# EAGLE design EC60_1 (EAGLE 7.4.1)
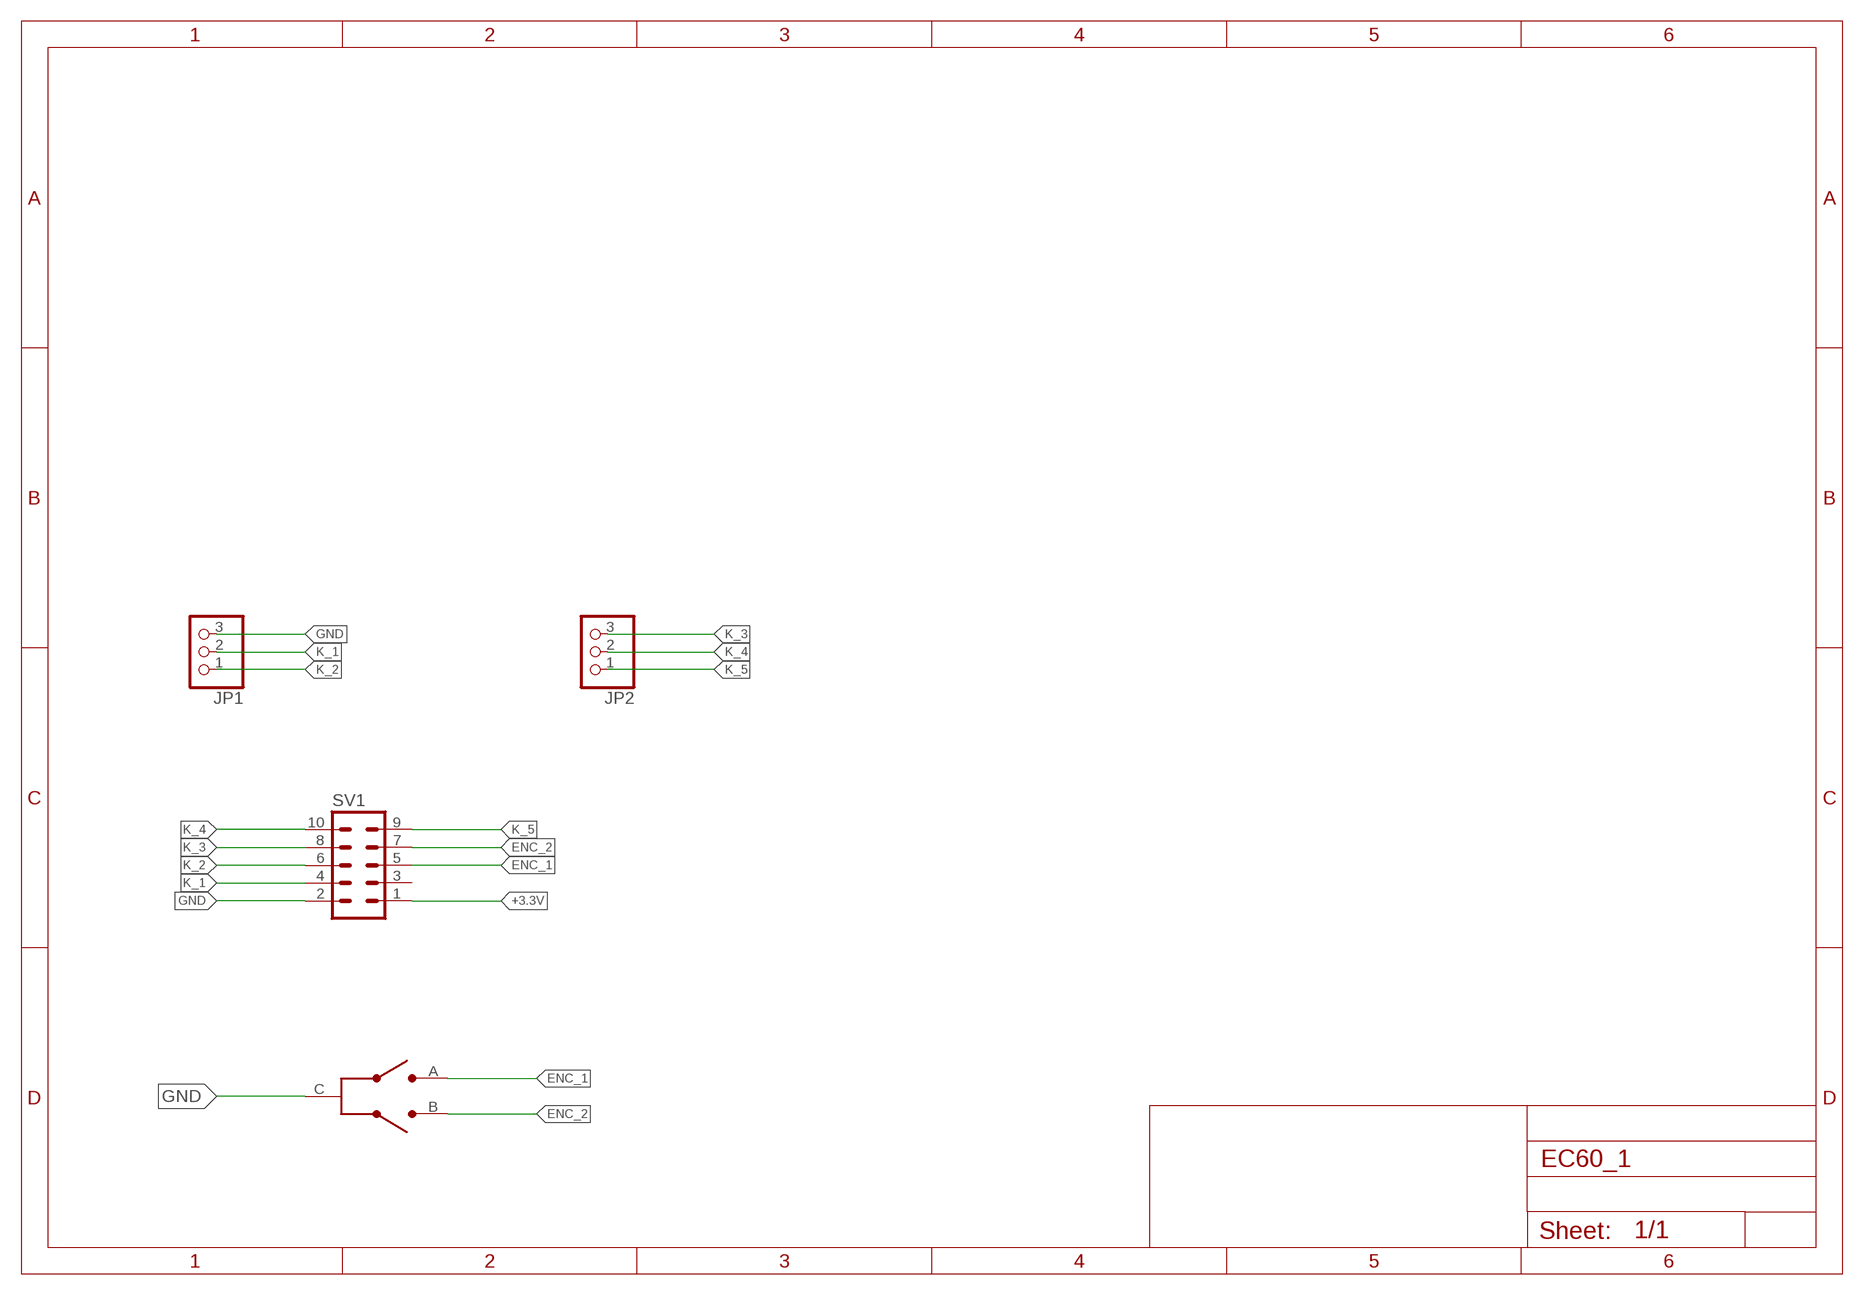
[diagram p0: schematic, sheet 1]

## Parts
JP1  PINHD-1X3  [1X03]
JP2  PINHD-1X3  [1X03]
SV1  ML10L  [ML10L]
U$1  EC60A  [EC60A]

## Nets
+3.3V: SV1.1
ENC_1 [SUPPLY]: SV1.5 U$1.A
ENC_2 [SUPPLY]: SV1.7 U$1.B
GND [SUPPLY]: JP1.3 SV1.2 U$1.C
K_1 [SUPPLY]: JP1.2 SV1.4
K_2 [SUPPLY]: JP1.1 SV1.6
K_3 [SUPPLY]: JP2.3 SV1.8
K_4 [SUPPLY]: JP2.2 SV1.10
K_5 [SUPPLY]: JP2.1 SV1.9
Unconnected: SV1.3

## Library data of the parts
JP1 JP2 = pinhead:PINHD-1X3: PIN HEADER
SV1 = con-harting-ml:ML10: HARTING; OC_FARNELL: unknown; OC_NEWARK: unknown
U$1 = ALPS-EC60A:EC60A

## Net classes
1 SUPPLY: width 0.254 mm

## Board
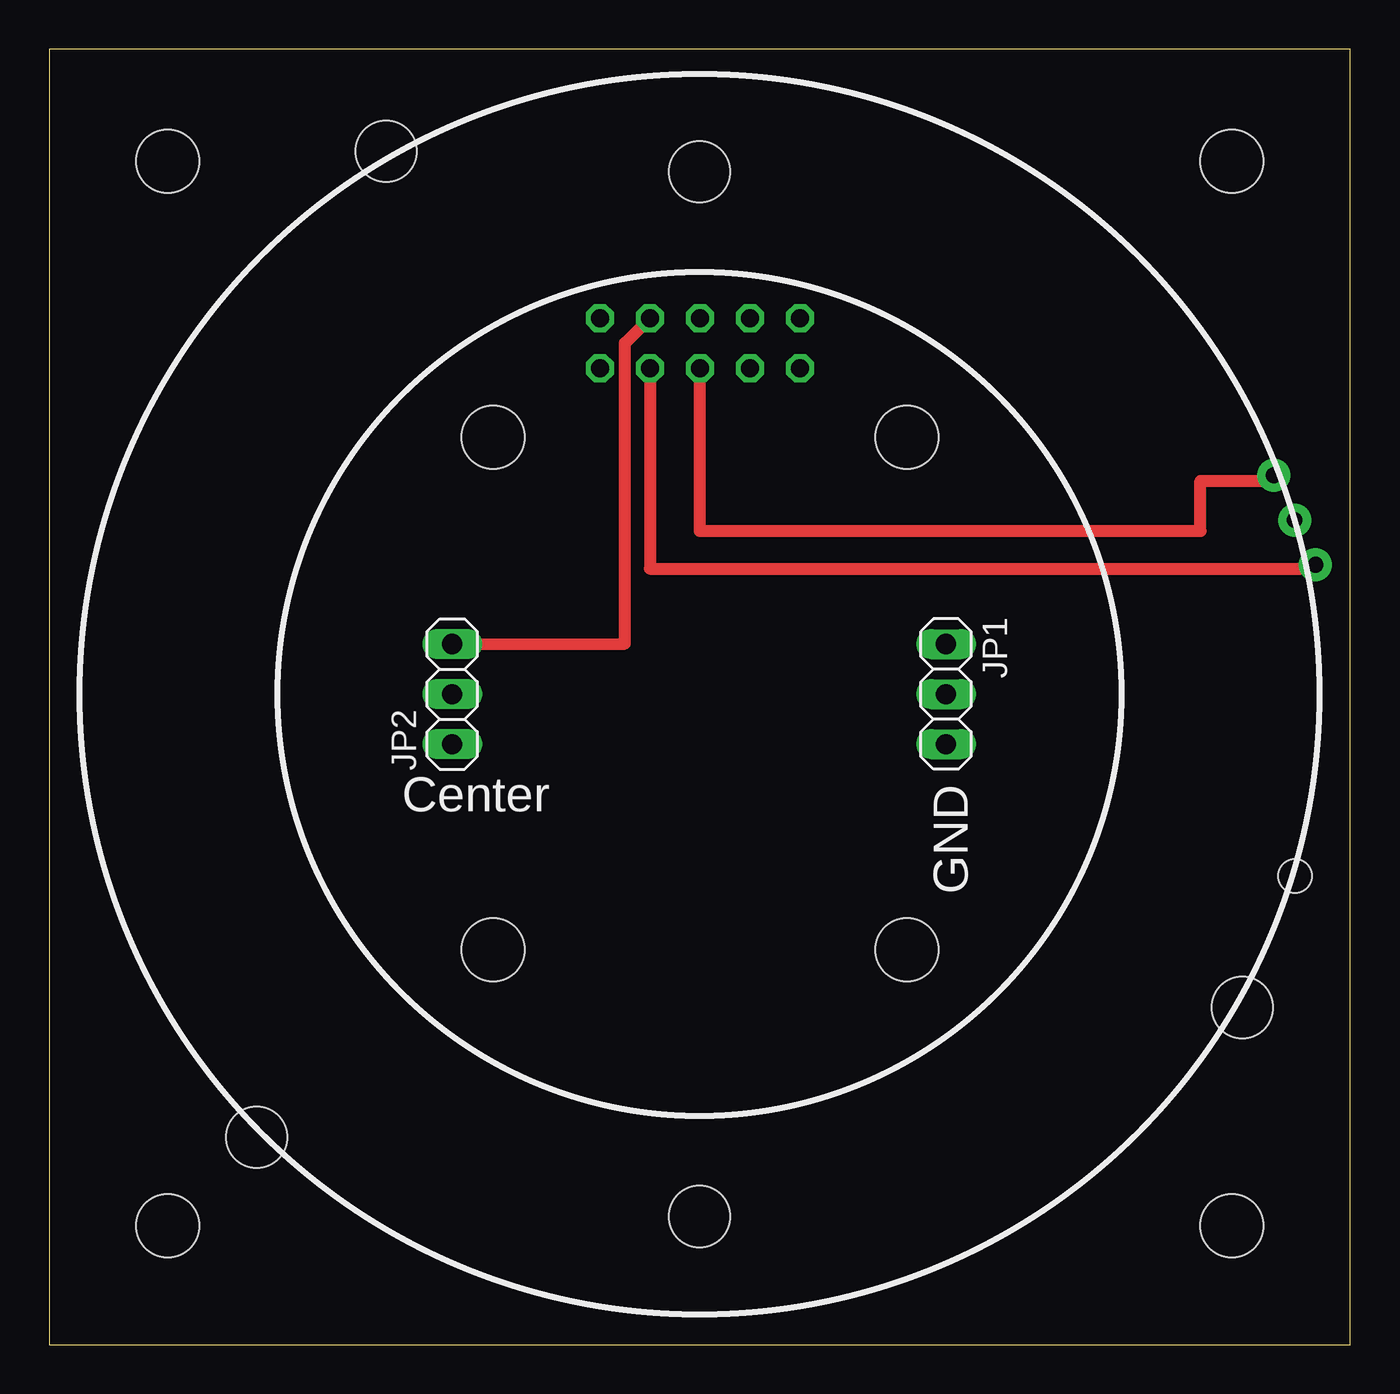
[diagram p1: board, top side]
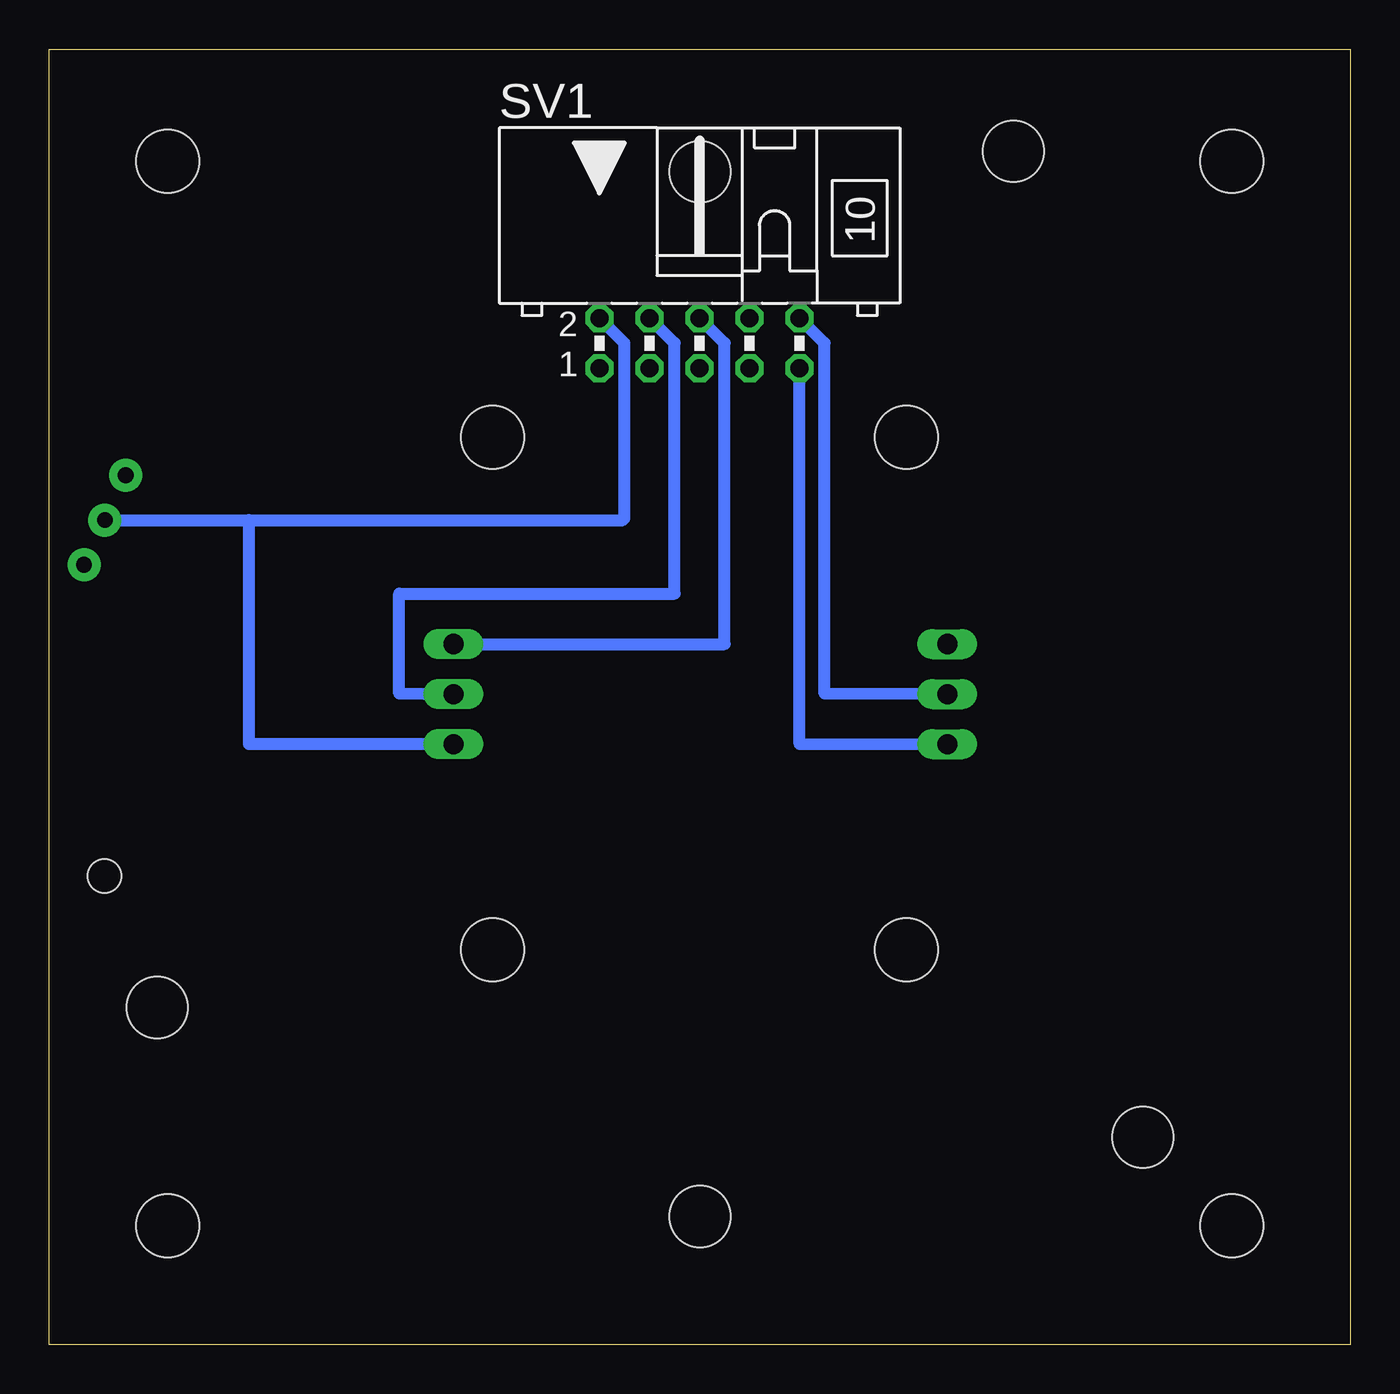
[diagram p2: board, bottom side, seen from below]

Size 66.02 x 65.71 mm. Coordinates in mm from the lower left corner, seen from the top.
Outline: 0,0 66.02,0 66.02,65.71 0,65.71 0,0
Copper layers (1*16): Top 0.035mm / dielectric 1.5mm / Bottom 0.035mm
Design rules "dirt_cheap_dirty_boards.v1": minimum track width 5mil, minimum drill 12mil, track to track 5mil, track to pad 5mil, pad to pad 5mil, via to via 5mil, smd to smd 0mil, copper to edge 10mil, drill to drill 10mil, minimum pad ring 10mil, minimum via ring 6mil, stop-mask expansion 2mil, vias tented up to drill 25mil, thermal gap 10mil
Holes 3.2 mm at 22.52,46.02 43.52,46.02 22.52,20.02 43.52,20.02 6.02,60.02 60.02,60.02 6.02,6.02 60.02,6.02

### Footprints (pad centres in the part's own frame; a part is rotated, then mirrored left to right if it is on the bottom)
1X03 = drill 1.016 long: 1 -2.54,0; 2 0,0; 3 2.54,0
ML10L = drill 0.914 octagon: 1 -5.08,-1.27; 2 -5.08,1.27; 3 -2.54,-1.27; 4 -2.54,1.27; 5 0,-1.27; 6 0,1.27; 7 2.54,-1.27; 8 2.54,1.27; 9 5.08,-1.27; 10 5.08,1.27
EC60A = drill 0.8 pad 1.676: A 29.141,11.095; B 31.254,6.564; C 30.198,8.829 | hole 3.1: 0,26.5; 0,-26.5; -15.9,27.54; -22.486,-22.486; 27.54,-15.9 | hole 1.7: 30.219,-9.239

### Placement (x,y rotation side)
JP1  45.51,33 270 top
JP2  20.45,33 90 top
SV1  33.02,50.8 0 bottom
U$1  33,33 0 top

### Tracks (layer width: path | path; a pad name or v marks a point on that pad's centre or on a via)
ENC_1
  Top 0.61: SV1.5 33.02,41.27 58.42,41.27 58.42,43.81 62.16,43.81 U$1.A
ENC_2
  Top 0.61: SV1.7 30.48,39.37 63.5,39.37 U$1.B
GND
  Bottom 0.406: 36.91,41.83 36.83,41.91 | 55.86,30.46 55.88,30.48
  Bottom 0.61: U$1.C 55.88,41.83 | 55.88,41.83 36.91,41.83 | 36.83,41.91 36.83,50.8 SV1.2 | JP1.3 55.86,30.46 | 55.88,30.48 55.88,41.83
K_1
  Bottom 0.406: JP1.2 46.97,33
  Bottom 0.61: 46.97,33 48.26,33.02 48.26,38.1 34.29,38.1 34.29,50.8 SV1.4
K_2
  Bottom 0.61: JP1.1 31.75,35.54 31.75,50.8 SV1.6
K_3
  Top 0.61: JP2.3 29.21,35.56 29.21,50.8 SV1.8
K_4
  Bottom 0.61: JP2.2 26.67,33.02 26.67,50.8 SV1.10
K_5
  Bottom 0.61: SV1.9 27.94,30.48 JP2.1

### Text on the board
tNames: Center | GND